# EAGLE schematic touch_w_scroll (EAGLE 9.6.2)
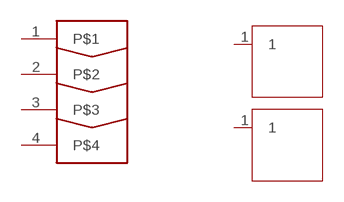
[diagram p0: schematic, sheet 1]

## Parts
U$1  SLIDE_PAD  [SLIDE]
U$2  12X12_PAD  [12X12_PAD]
U$4  12X12_PADLED  [12X12_PAD_LED]
Unconnected: U$1.1 U$1.2 U$1.3 U$1.4 U$2.1 U$4.1

## Library data of the parts
U$1 = Cap Touch Pads:SLIDE_PAD
U$2 U$4 = Cap Touch Pads:12X12_PAD